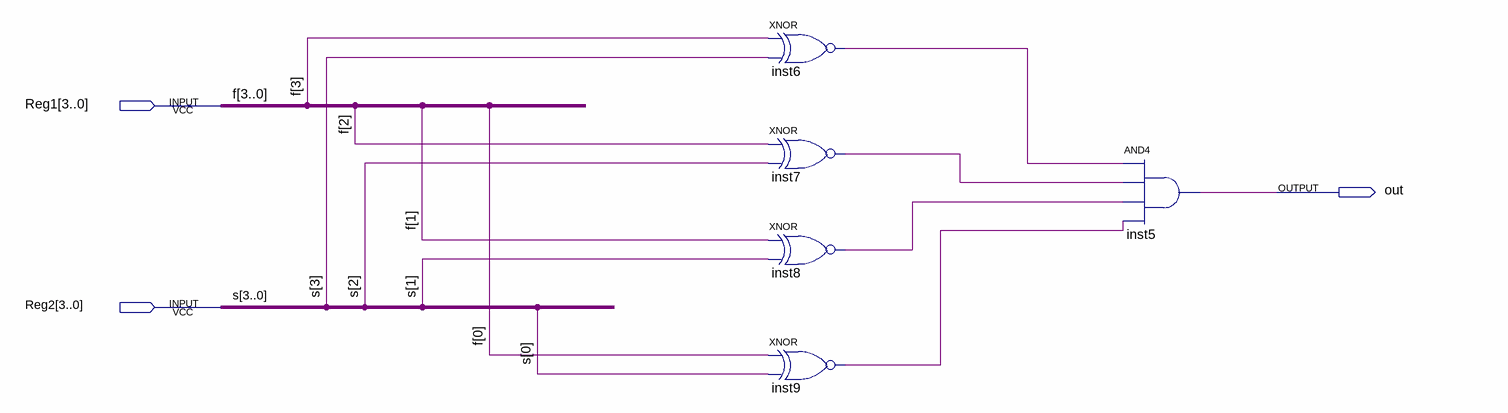
[diagram p0: schematic sheet]
// Quartus schematic fourbit_comparator.bdf as structural Verilog: 5 symbols, 3 pins
module fourbit_comparator (
  input  [3:0] Reg1,
  input  [3:0] Reg2,
  output out
);

  wire inst6_out, inst7_out, inst8_out, inst9_out;

  xnor inst6 (inst6_out, Reg1[3], Reg2[3]);
  xnor inst7 (inst7_out, Reg1[2], Reg2[2]);
  xnor inst8 (inst8_out, Reg1[1], Reg2[1]);
  xnor inst9 (inst9_out, Reg1[0], Reg2[0]);
  and inst5 (out, inst6_out, inst7_out, inst8_out, inst9_out);

  // Other names for the same wires on the sheet: f[3:0] = Reg1; s[3:0] = Reg2
endmodule
